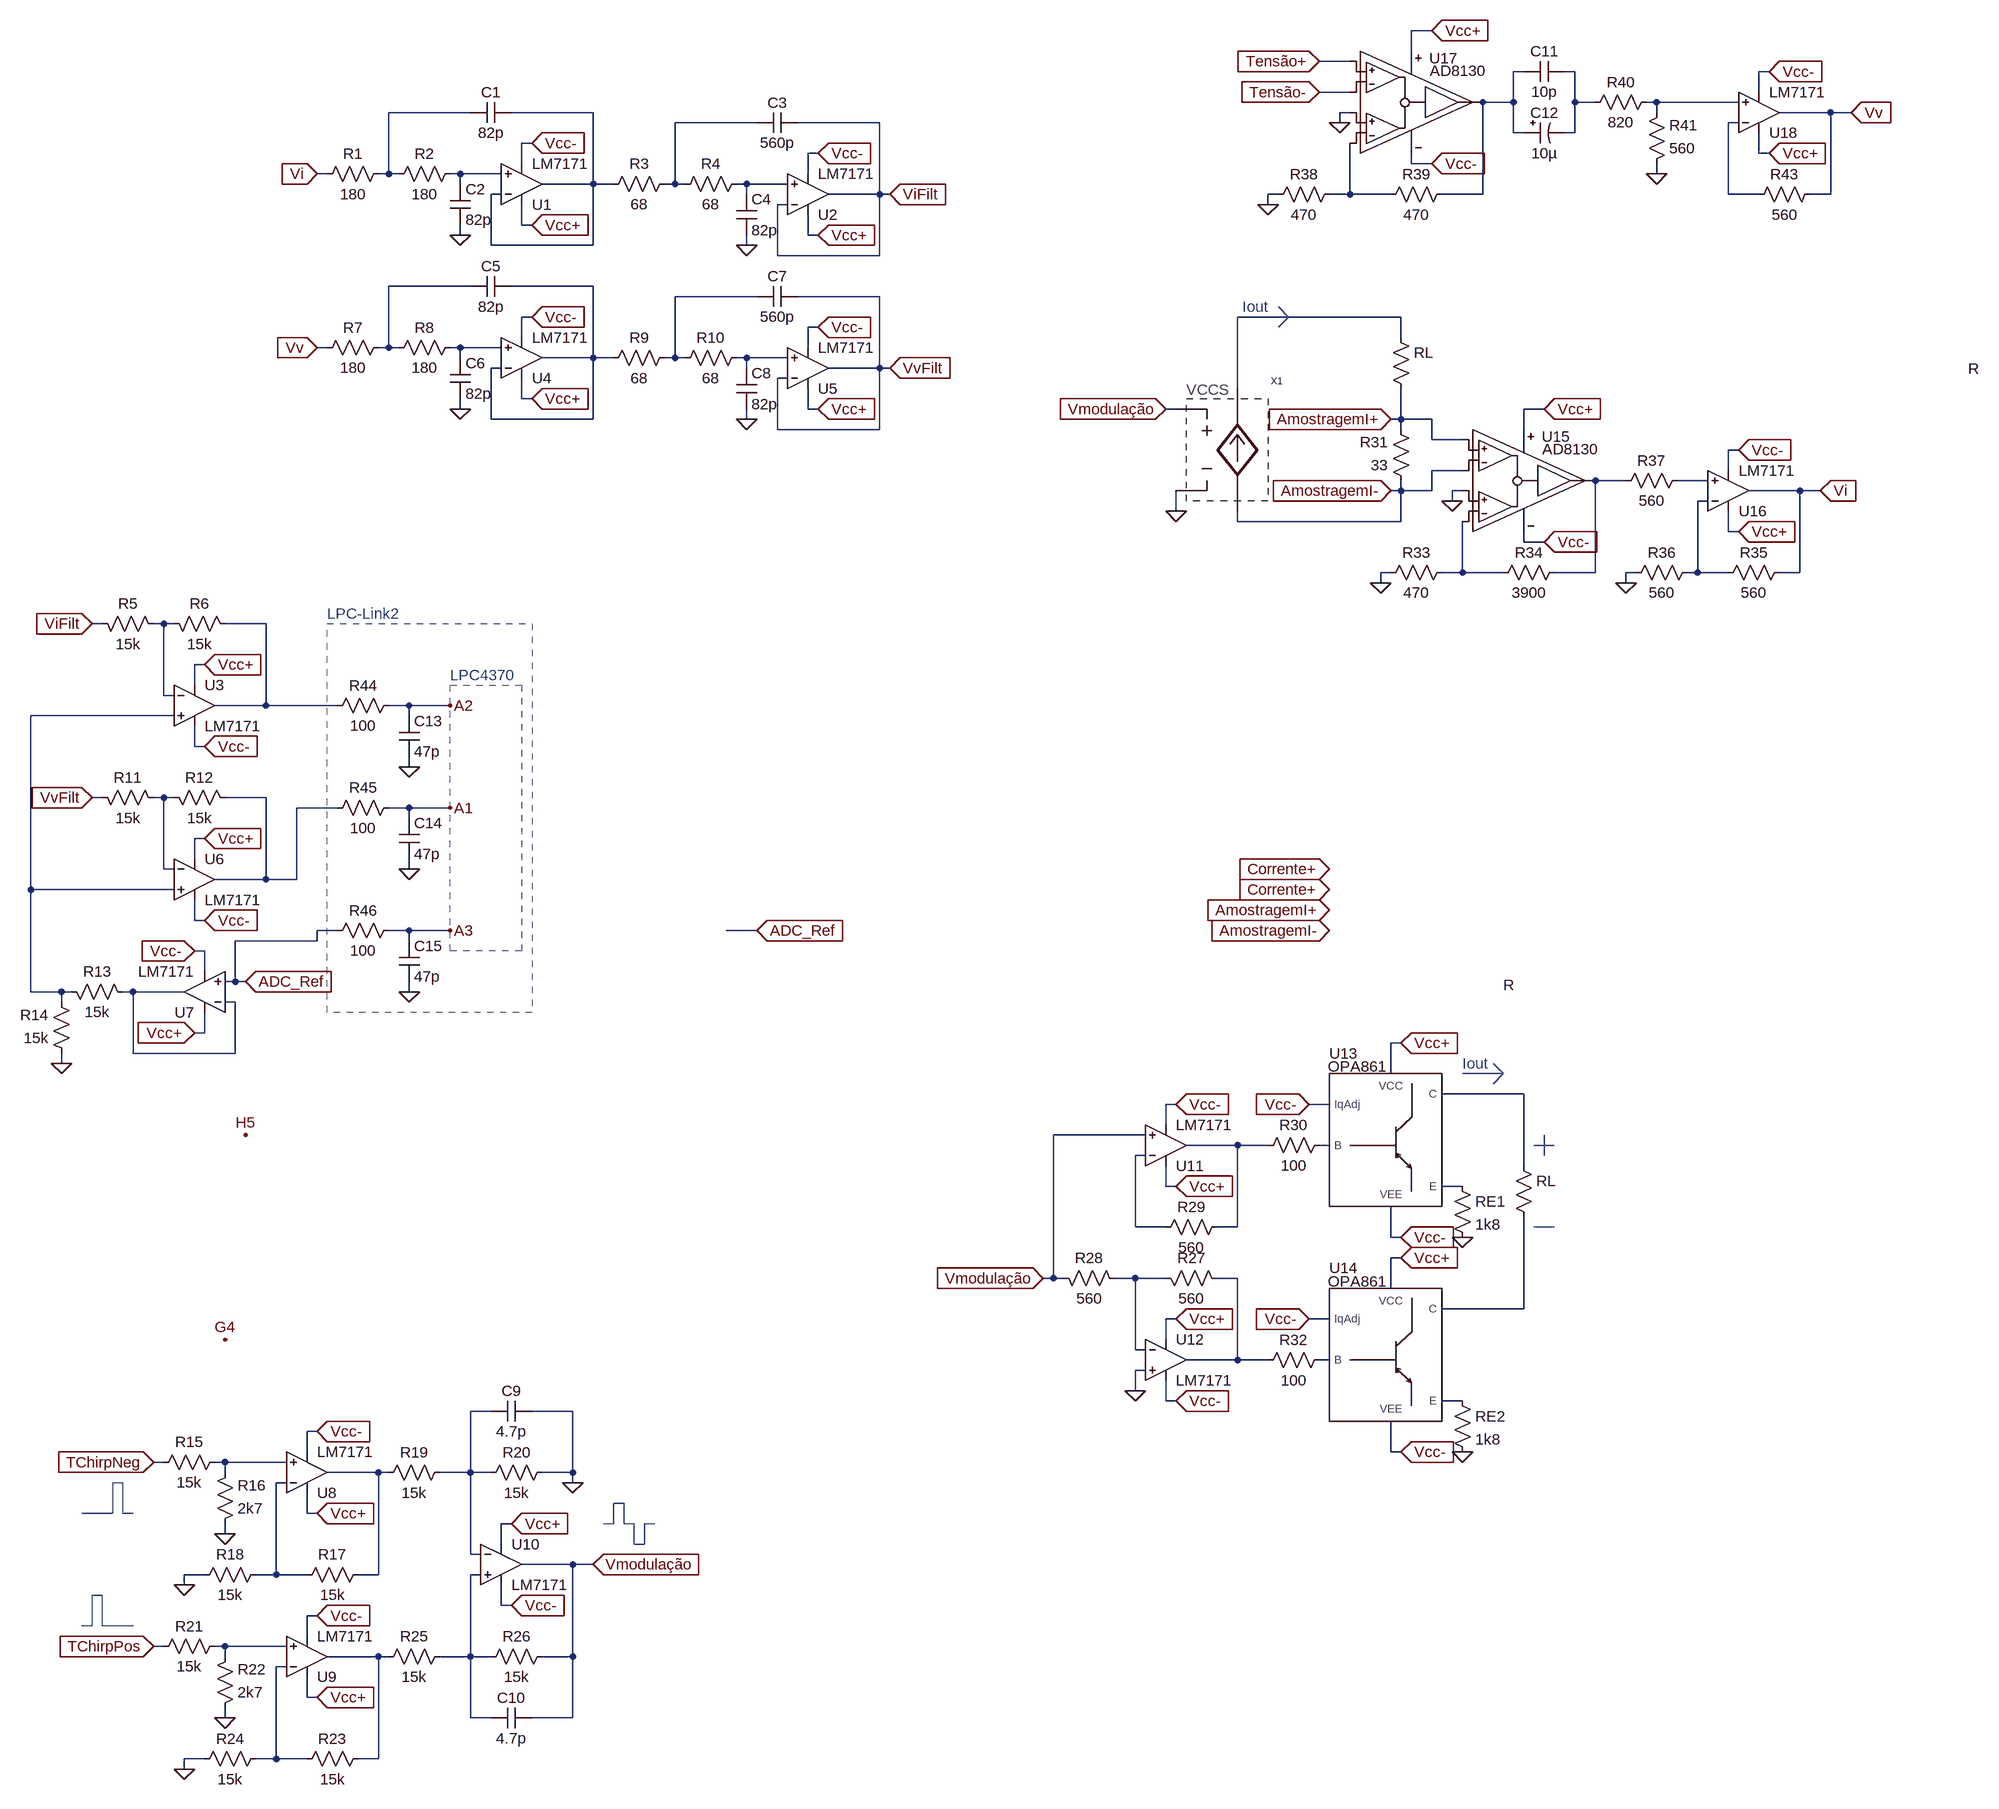
[diagram p0: schematic Circuito completo.asc]
Circuito completo.asc, the LTspice schematic file:
Version 4
SHEET 1 960 1104
WIRE -3152 -1648 -3184 -1648
WIRE -3184 -1616 -3184 -1648
WIRE -3280 -1600 -3328 -1600
WIRE -3008 -1584 -3024 -1584
WIRE -2928 -1584 -2944 -1584
WIRE -2624 -1584 -2640 -1584
WIRE -3280 -1552 -3328 -1552
WIRE -2640 -1552 -2640 -1584
WIRE -3024 -1536 -3024 -1584
WIRE -3024 -1536 -3072 -1536
WIRE -2928 -1536 -2928 -1584
WIRE -2896 -1536 -2928 -1536
WIRE -2800 -1536 -2816 -1536
WIRE -2672 -1536 -2800 -1536
WIRE -4656 -1520 -4784 -1520
WIRE -4464 -1520 -4592 -1520
WIRE -3280 -1520 -3296 -1520
WIRE -2800 -1520 -2800 -1536
WIRE -2528 -1520 -2608 -1520
WIRE -2496 -1520 -2528 -1520
WIRE -4208 -1504 -4336 -1504
WIRE -4016 -1504 -4144 -1504
WIRE -3296 -1504 -3296 -1520
WIRE -2672 -1504 -2688 -1504
WIRE -3024 -1488 -3024 -1536
WIRE -3008 -1488 -3024 -1488
WIRE -2928 -1488 -2928 -1536
WIRE -2928 -1488 -2944 -1488
WIRE -4560 -1472 -4576 -1472
WIRE -4112 -1456 -4128 -1456
WIRE -2640 -1456 -2640 -1488
WIRE -2624 -1456 -2640 -1456
WIRE -4576 -1440 -4576 -1472
WIRE -3184 -1440 -3184 -1456
WIRE -3152 -1440 -3184 -1440
WIRE -4880 -1424 -4896 -1424
WIRE -4784 -1424 -4784 -1520
WIRE -4784 -1424 -4800 -1424
WIRE -4768 -1424 -4784 -1424
WIRE -4672 -1424 -4688 -1424
WIRE -4608 -1424 -4672 -1424
WIRE -4128 -1424 -4128 -1456
WIRE -2800 -1424 -2800 -1440
WIRE -4672 -1408 -4672 -1424
WIRE -4464 -1408 -4464 -1520
WIRE -4464 -1408 -4544 -1408
WIRE -4432 -1408 -4464 -1408
WIRE -4336 -1408 -4336 -1504
WIRE -4336 -1408 -4352 -1408
WIRE -4320 -1408 -4336 -1408
WIRE -4224 -1408 -4240 -1408
WIRE -4160 -1408 -4224 -1408
WIRE -4608 -1392 -4624 -1392
WIRE -4224 -1392 -4224 -1408
WIRE -4016 -1392 -4016 -1504
WIRE -4016 -1392 -4096 -1392
WIRE -4000 -1392 -4016 -1392
WIRE -3392 -1392 -3408 -1392
WIRE -3280 -1392 -3280 -1472
WIRE -3280 -1392 -3312 -1392
WIRE -3216 -1392 -3280 -1392
WIRE -3072 -1392 -3072 -1536
WIRE -3072 -1392 -3136 -1392
WIRE -2688 -1392 -2688 -1504
WIRE -2640 -1392 -2688 -1392
WIRE -2528 -1392 -2528 -1520
WIRE -2528 -1392 -2560 -1392
WIRE -4160 -1376 -4176 -1376
WIRE -3408 -1376 -3408 -1392
WIRE -4576 -1344 -4576 -1376
WIRE -4560 -1344 -4576 -1344
WIRE -4672 -1328 -4672 -1344
WIRE -4128 -1328 -4128 -1360
WIRE -4112 -1328 -4128 -1328
WIRE -4624 -1312 -4624 -1392
WIRE -4464 -1312 -4464 -1408
WIRE -4464 -1312 -4624 -1312
WIRE -4224 -1312 -4224 -1328
WIRE -4176 -1296 -4176 -1376
WIRE -4016 -1296 -4016 -1392
WIRE -4016 -1296 -4176 -1296
WIRE -4656 -1248 -4784 -1248
WIRE -4464 -1248 -4592 -1248
WIRE -4208 -1232 -4336 -1232
WIRE -4016 -1232 -4144 -1232
WIRE -4560 -1200 -4576 -1200
WIRE -3200 -1200 -3456 -1200
WIRE -4112 -1184 -4128 -1184
WIRE -4576 -1168 -4576 -1200
WIRE -3200 -1168 -3200 -1200
WIRE -4880 -1152 -4896 -1152
WIRE -4784 -1152 -4784 -1248
WIRE -4784 -1152 -4800 -1152
WIRE -4768 -1152 -4784 -1152
WIRE -4672 -1152 -4688 -1152
WIRE -4608 -1152 -4672 -1152
WIRE -4128 -1152 -4128 -1184
WIRE -4672 -1136 -4672 -1152
WIRE -4464 -1136 -4464 -1248
WIRE -4464 -1136 -4544 -1136
WIRE -4432 -1136 -4464 -1136
WIRE -4336 -1136 -4336 -1232
WIRE -4336 -1136 -4352 -1136
WIRE -4320 -1136 -4336 -1136
WIRE -4224 -1136 -4240 -1136
WIRE -4160 -1136 -4224 -1136
WIRE -4608 -1120 -4624 -1120
WIRE -4224 -1120 -4224 -1136
WIRE -4016 -1120 -4016 -1232
WIRE -4016 -1120 -4096 -1120
WIRE -4000 -1120 -4016 -1120
WIRE -4160 -1104 -4176 -1104
WIRE -3456 -1088 -3456 -1200
WIRE -4576 -1072 -4576 -1104
WIRE -4560 -1072 -4576 -1072
WIRE -4672 -1056 -4672 -1072
WIRE -4128 -1056 -4128 -1088
WIRE -4112 -1056 -4128 -1056
WIRE -3552 -1056 -3568 -1056
WIRE -2976 -1056 -3008 -1056
WIRE -4624 -1040 -4624 -1120
WIRE -4464 -1040 -4464 -1136
WIRE -4464 -1040 -4624 -1040
WIRE -4224 -1040 -4224 -1056
WIRE -3200 -1040 -3200 -1088
WIRE -3200 -1040 -3216 -1040
WIRE -3152 -1040 -3200 -1040
WIRE -4176 -1024 -4176 -1104
WIRE -4016 -1024 -4016 -1120
WIRE -4016 -1024 -4176 -1024
WIRE -3200 -1024 -3200 -1040
WIRE -3008 -1024 -3008 -1056
WIRE -3152 -1008 -3152 -1040
WIRE -3104 -1008 -3152 -1008
WIRE -2672 -992 -2688 -992
WIRE -3104 -960 -3152 -960
WIRE -2688 -960 -2688 -992
WIRE -2848 -944 -2896 -944
WIRE -2720 -944 -2768 -944
WIRE -3200 -928 -3200 -944
WIRE -3200 -928 -3216 -928
WIRE -3152 -928 -3152 -960
WIRE -3152 -928 -3200 -928
WIRE -3104 -928 -3120 -928
WIRE -2576 -928 -2656 -928
WIRE -2544 -928 -2576 -928
WIRE -3120 -912 -3120 -928
WIRE -2720 -912 -2736 -912
WIRE -3552 -896 -3552 -928
WIRE -3456 -880 -3456 -896
WIRE -3200 -880 -3200 -928
WIRE -3200 -880 -3456 -880
WIRE -2688 -864 -2688 -896
WIRE -2672 -864 -2688 -864
WIRE -3008 -848 -3008 -864
WIRE -2976 -848 -3008 -848
WIRE -3216 -800 -3232 -800
WIRE -3104 -800 -3104 -880
WIRE -3104 -800 -3136 -800
WIRE -3040 -800 -3104 -800
WIRE -2896 -800 -2896 -944
WIRE -2896 -800 -2960 -800
WIRE -2832 -800 -2848 -800
WIRE -2736 -800 -2736 -912
WIRE -2736 -800 -2752 -800
WIRE -2688 -800 -2736 -800
WIRE -2576 -800 -2576 -928
WIRE -2576 -800 -2608 -800
WIRE -3232 -784 -3232 -800
WIRE -2848 -784 -2848 -800
WIRE -5232 -720 -5248 -720
WIRE -5136 -720 -5152 -720
WIRE -5120 -720 -5136 -720
WIRE -4976 -720 -5040 -720
WIRE -5072 -656 -5088 -656
WIRE -5088 -624 -5088 -656
WIRE -5136 -608 -5136 -720
WIRE -5120 -608 -5136 -608
WIRE -4976 -592 -4976 -720
WIRE -4976 -592 -5056 -592
WIRE -4864 -592 -4976 -592
WIRE -4752 -592 -4784 -592
WIRE -4688 -592 -4752 -592
WIRE -5120 -576 -5344 -576
WIRE -4752 -576 -4752 -592
WIRE -5088 -528 -5088 -560
WIRE -5072 -528 -5088 -528
WIRE -4752 -496 -4752 -512
WIRE -5232 -448 -5248 -448
WIRE -5136 -448 -5152 -448
WIRE -5120 -448 -5136 -448
WIRE -4976 -448 -5040 -448
WIRE -4864 -432 -4928 -432
WIRE -4752 -432 -4784 -432
WIRE -4688 -432 -4752 -432
WIRE -4752 -416 -4752 -432
WIRE -5072 -384 -5088 -384
WIRE -5088 -352 -5088 -384
WIRE -5136 -336 -5136 -448
WIRE -5120 -336 -5136 -336
WIRE -4752 -336 -4752 -352
WIRE -4976 -320 -4976 -448
WIRE -4976 -320 -5056 -320
WIRE -4928 -320 -4928 -432
WIRE -4928 -320 -4976 -320
WIRE -5344 -304 -5344 -576
WIRE -5120 -304 -5344 -304
WIRE -5088 -256 -5088 -288
WIRE -5072 -256 -5088 -256
WIRE -4864 -240 -4896 -240
WIRE -4752 -240 -4784 -240
WIRE -4688 -240 -4752 -240
WIRE -4208 -240 -4256 -240
WIRE -4896 -224 -4896 -240
WIRE -4896 -224 -5024 -224
WIRE -4752 -224 -4752 -240
WIRE -5072 -208 -5088 -208
WIRE -5072 -176 -5072 -208
WIRE -5024 -160 -5024 -224
WIRE -5024 -160 -5040 -160
WIRE -5008 -160 -5024 -160
WIRE -5344 -144 -5344 -304
WIRE -5296 -144 -5344 -144
WIRE -5280 -144 -5296 -144
WIRE -5184 -144 -5200 -144
WIRE -5104 -144 -5184 -144
WIRE -4752 -144 -4752 -160
WIRE -5296 -128 -5296 -144
WIRE -5024 -128 -5040 -128
WIRE -5072 -80 -5072 -112
WIRE -5072 -80 -5088 -80
WIRE -3200 -64 -3216 -64
WIRE -5184 -48 -5184 -144
WIRE -5024 -48 -5024 -128
WIRE -5024 -48 -5184 -48
WIRE -5296 -32 -5296 -48
WIRE -3216 -16 -3216 -64
WIRE -3008 16 -3136 16
WIRE -3552 32 -3568 32
WIRE -3312 32 -3344 32
WIRE -3568 64 -3568 32
WIRE -3600 80 -3744 80
WIRE -3456 96 -3536 96
WIRE -3408 96 -3456 96
WIRE -3312 96 -3328 96
WIRE -3600 112 -3616 112
WIRE -3008 128 -3008 16
WIRE -3568 160 -3568 128
WIRE -3552 160 -3568 160
WIRE -3104 160 -3136 160
WIRE -3616 224 -3616 112
WIRE -3568 224 -3616 224
WIRE -3456 224 -3456 96
WIRE -3456 224 -3488 224
WIRE -3216 240 -3216 192
WIRE -3200 240 -3216 240
WIRE -3200 272 -3216 272
WIRE -3744 304 -3744 80
WIRE -3744 304 -3760 304
WIRE -3728 304 -3744 304
WIRE -3616 304 -3648 304
WIRE -3568 304 -3616 304
WIRE -3456 304 -3488 304
WIRE -3216 320 -3216 272
WIRE -3008 352 -3008 208
WIRE -3008 352 -3136 352
WIRE -3552 368 -3568 368
WIRE -3312 368 -3344 368
WIRE -3568 400 -3568 368
WIRE -3616 416 -3616 304
WIRE -3600 416 -3616 416
WIRE -3456 432 -3456 304
WIRE -3456 432 -3536 432
WIRE -3408 432 -3456 432
WIRE -3312 432 -3328 432
WIRE -3600 448 -3616 448
WIRE -3616 480 -3616 448
WIRE -3568 496 -3568 464
WIRE -3552 496 -3568 496
WIRE -3104 496 -3136 496
WIRE -4624 512 -4656 512
WIRE -4496 512 -4560 512
WIRE -4896 544 -4912 544
WIRE -4912 576 -4912 544
WIRE -3216 576 -3216 528
WIRE -3200 576 -3216 576
WIRE -5136 592 -5152 592
WIRE -5040 592 -5056 592
WIRE -4944 592 -5040 592
WIRE -5040 608 -5040 592
WIRE -4800 608 -4880 608
WIRE -4784 608 -4800 608
WIRE -4656 608 -4656 512
WIRE -4656 608 -4704 608
WIRE -4624 608 -4656 608
WIRE -4496 608 -4496 512
WIRE -4496 608 -4544 608
WIRE -4944 624 -4960 624
WIRE -4496 624 -4496 608
WIRE -4912 672 -4912 640
WIRE -4896 672 -4912 672
WIRE -4592 688 -4608 688
WIRE -5040 704 -5040 688
WIRE -4608 720 -4608 688
WIRE -4656 736 -4656 608
WIRE -4640 736 -4656 736
WIRE -4496 752 -4576 752
WIRE -4464 752 -4496 752
WIRE -5072 768 -5104 768
WIRE -4960 768 -4960 624
WIRE -4960 768 -4992 768
WIRE -4912 768 -4960 768
WIRE -4800 768 -4800 608
WIRE -4800 768 -4832 768
WIRE -4640 768 -4656 768
WIRE -5104 784 -5104 768
WIRE -4608 816 -4608 784
WIRE -4592 816 -4608 816
WIRE -4896 832 -4912 832
WIRE -4912 864 -4912 832
WIRE -5136 880 -5152 880
WIRE -5040 880 -5056 880
WIRE -4944 880 -5040 880
WIRE -5040 896 -5040 880
WIRE -4800 896 -4880 896
WIRE -4784 896 -4800 896
WIRE -4656 896 -4656 768
WIRE -4656 896 -4704 896
WIRE -4624 896 -4656 896
WIRE -4496 896 -4496 752
WIRE -4496 896 -4544 896
WIRE -4944 912 -4960 912
WIRE -4912 960 -4912 928
WIRE -4896 960 -4912 960
WIRE -5040 992 -5040 976
WIRE -4656 992 -4656 896
WIRE -4624 992 -4656 992
WIRE -4496 992 -4496 896
WIRE -4496 992 -4560 992
WIRE -5072 1056 -5104 1056
WIRE -4960 1056 -4960 912
WIRE -4960 1056 -4992 1056
WIRE -4912 1056 -4960 1056
WIRE -4800 1056 -4800 896
WIRE -4800 1056 -4832 1056
WIRE -5104 1072 -5104 1056
FLAG -4672 -1328 0
FLAG -4560 -1344 Vcc+
IOPIN -4560 -1344 In
FLAG -4560 -1472 Vcc-
IOPIN -4560 -1472 In
FLAG -4224 -1312 0
FLAG -4112 -1328 Vcc+
IOPIN -4112 -1328 In
FLAG -4112 -1456 Vcc-
IOPIN -4112 -1456 In
FLAG -5072 -656 Vcc+
IOPIN -5072 -656 In
FLAG -5072 -528 Vcc-
IOPIN -5072 -528 In
FLAG -4672 -1056 0
FLAG -4560 -1072 Vcc+
IOPIN -4560 -1072 In
FLAG -4560 -1200 Vcc-
IOPIN -4560 -1200 In
FLAG -4224 -1040 0
FLAG -4112 -1056 Vcc+
IOPIN -4112 -1056 In
FLAG -4112 -1184 Vcc-
IOPIN -4112 -1184 In
FLAG -5072 -384 Vcc+
IOPIN -5072 -384 In
FLAG -5072 -256 Vcc-
IOPIN -5072 -256 In
FLAG -5088 -80 Vcc+
IOPIN -5088 -80 In
FLAG -5088 -208 Vcc-
IOPIN -5088 -208 In
FLAG -5296 -32 0
FLAG -4208 -240 ADC_Ref
IOPIN -4208 -240 In
FLAG -4896 672 Vcc+
IOPIN -4896 672 In
FLAG -4896 544 Vcc-
IOPIN -4896 544 In
FLAG -5040 704 0
FLAG -4896 960 Vcc+
IOPIN -4896 960 In
FLAG -4896 832 Vcc-
IOPIN -4896 832 In
FLAG -5040 992 0
FLAG -4592 688 Vcc+
IOPIN -4592 688 In
FLAG -4592 816 Vcc-
IOPIN -4592 816 In
FLAG -4496 624 0
FLAG -5152 592 TChirpNeg
IOPIN -5152 592 In
FLAG -5152 880 TChirpPos
IOPIN -5152 880 In
FLAG -5104 1072 0
FLAG -5104 784 0
FLAG -3552 160 Vcc+
IOPIN -3552 160 In
FLAG -3552 32 Vcc-
IOPIN -3552 32 In
FLAG -3552 368 Vcc+
IOPIN -3552 368 In
FLAG -3552 496 Vcc-
IOPIN -3552 496 In
FLAG -3200 240 Vcc-
IOPIN -3200 240 In
FLAG -3200 -64 Vcc+
IOPIN -3200 -64 In
FLAG -3104 240 0
FLAG -3200 576 Vcc-
IOPIN -3200 576 In
FLAG -3200 272 Vcc+
IOPIN -3200 272 In
FLAG -3104 576 0
FLAG -3344 32 Vcc-
IOPIN -3344 32 In
FLAG -3344 368 Vcc-
IOPIN -3344 368 In
FLAG -3120 -912 0
FLAG -3232 -784 0
FLAG -2672 -864 Vcc+
IOPIN -2672 -864 In
FLAG -2672 -992 Vcc-
IOPIN -2672 -992 In
FLAG -2848 -784 0
FLAG -2976 -848 Vcc-
IOPIN -2976 -848 In
FLAG -2976 -1056 Vcc+
IOPIN -2976 -1056 In
FLAG -3312 -240 AmostragemI-
IOPIN -3312 -240 In
FLAG -3312 -272 AmostragemI+
IOPIN -3312 -272 In
FLAG -3216 -928 AmostragemI-
IOPIN -3216 -928 In
FLAG -3216 -1040 AmostragemI+
IOPIN -3216 -1040 In
FLAG -3296 -1504 0
FLAG -3408 -1376 0
FLAG -2624 -1456 Vcc+
IOPIN -2624 -1456 In
FLAG -2624 -1584 Vcc-
IOPIN -2624 -1584 In
FLAG -3152 -1440 Vcc-
IOPIN -3152 -1440 In
FLAG -3152 -1648 Vcc+
IOPIN -3152 -1648 In
FLAG -3328 -1552 Tensão-
IOPIN -3328 -1552 In
FLAG -3328 -1600 Tensão+
IOPIN -3328 -1600 In
FLAG -2800 -1424 0
FLAG -2544 -928 Vi
IOPIN -2544 -928 In
FLAG -2496 -1520 Vv
IOPIN -2496 -1520 In
FLAG -3312 -304 Corrente+
IOPIN -3312 -304 In
FLAG -3312 -336 Corrente+
IOPIN -3312 -336 In
FLAG -4752 -496 0
FLAG -4752 -336 0
FLAG -4896 -1424 Vi
IOPIN -4896 -1424 In
FLAG -4896 -1152 Vv
IOPIN -4896 -1152 In
FLAG -4752 -144 0
FLAG -5008 -160 ADC_Ref
IOPIN -5008 -160 In
FLAG -4688 -592 A2
FLAG -4688 -432 A1
FLAG -4688 -240 A3
FLAG -3760 304 Vmodulação
IOPIN -3760 304 In
FLAG -4464 752 Vmodulação
IOPIN -4464 752 In
FLAG -5008 80 H5
FLAG -5040 400 G4
FLAG -4000 -1392 ViFilt
IOPIN -4000 -1392 In
FLAG -4000 -1120 VvFilt
IOPIN -4000 -1120 In
FLAG -5248 -720 ViFilt
IOPIN -5248 -720 In
FLAG -5248 -448 VvFilt
IOPIN -5248 -448 In
FLAG -3616 480 0
FLAG -3568 -1056 Vmodulação
IOPIN -3568 -1056 In
FLAG -3552 -896 0
SYMBOL Opamps\\opamp2 -4576 -1344 M180
SYMATTR InstName U1
SYMATTR Value LM7171
SYMBOL res -4784 -1440 R90
WINDOW 0 0 56 VBottom 2
WINDOW 3 32 56 VTop 2
SYMATTR InstName R1
SYMATTR Value 180
SYMBOL res -4672 -1440 R90
WINDOW 0 0 56 VBottom 2
WINDOW 3 32 56 VTop 2
SYMATTR InstName R2
SYMATTR Value 180
SYMBOL cap -4592 -1536 R90
WINDOW 0 0 32 VBottom 2
WINDOW 3 32 32 VTop 2
SYMATTR InstName C1
SYMATTR Value 82p
SYMBOL cap -4688 -1408 R0
SYMATTR InstName C2
SYMATTR Value 82p
SYMBOL Opamps\\opamp2 -4128 -1328 M180
SYMATTR InstName U2
SYMATTR Value LM7171
SYMBOL res -4336 -1424 R90
WINDOW 0 0 56 VBottom 2
WINDOW 3 32 56 VTop 2
SYMATTR InstName R3
SYMATTR Value 68
SYMBOL res -4224 -1424 R90
WINDOW 0 0 56 VBottom 2
WINDOW 3 32 56 VTop 2
SYMATTR InstName R4
SYMATTR Value 68
SYMBOL cap -4144 -1520 R90
WINDOW 0 0 32 VBottom 2
WINDOW 3 32 32 VTop 2
SYMATTR InstName C3
SYMATTR Value 560p
SYMBOL cap -4240 -1392 R0
SYMATTR InstName C4
SYMATTR Value 82p
SYMBOL Opamps\\opamp2 -5088 -656 R0
SYMATTR InstName U3
SYMATTR Value LM7171
SYMBOL res -5136 -704 M270
WINDOW 0 32 56 VTop 2
WINDOW 3 0 56 VBottom 2
SYMATTR InstName R5
SYMATTR Value 15k
SYMBOL res -5024 -704 M270
WINDOW 0 32 56 VTop 2
WINDOW 3 0 56 VBottom 2
SYMATTR InstName R6
SYMATTR Value 15k
SYMBOL Opamps\\opamp2 -4576 -1072 M180
SYMATTR InstName U4
SYMATTR Value LM7171
SYMBOL res -4784 -1168 R90
WINDOW 0 0 56 VBottom 2
WINDOW 3 32 56 VTop 2
SYMATTR InstName R7
SYMATTR Value 180
SYMBOL res -4672 -1168 R90
WINDOW 0 0 56 VBottom 2
WINDOW 3 32 56 VTop 2
SYMATTR InstName R8
SYMATTR Value 180
SYMBOL cap -4592 -1264 R90
WINDOW 0 0 32 VBottom 2
WINDOW 3 32 32 VTop 2
SYMATTR InstName C5
SYMATTR Value 82p
SYMBOL cap -4688 -1136 R0
SYMATTR InstName C6
SYMATTR Value 82p
SYMBOL Opamps\\opamp2 -4128 -1056 M180
SYMATTR InstName U5
SYMATTR Value LM7171
SYMBOL res -4336 -1152 R90
WINDOW 0 0 56 VBottom 2
WINDOW 3 32 56 VTop 2
SYMATTR InstName R9
SYMATTR Value 68
SYMBOL res -4224 -1152 R90
WINDOW 0 0 56 VBottom 2
WINDOW 3 32 56 VTop 2
SYMATTR InstName R10
SYMATTR Value 68
SYMBOL cap -4144 -1248 R90
WINDOW 0 0 32 VBottom 2
WINDOW 3 32 32 VTop 2
SYMATTR InstName C7
SYMATTR Value 560p
SYMBOL cap -4240 -1120 R0
SYMATTR InstName C8
SYMATTR Value 82p
SYMBOL Opamps\\opamp2 -5088 -384 R0
SYMATTR InstName U6
SYMATTR Value LM7171
SYMBOL res -5136 -432 M270
WINDOW 0 32 56 VTop 2
WINDOW 3 0 56 VBottom 2
SYMATTR InstName R11
SYMATTR Value 15k
SYMBOL res -5024 -432 M270
WINDOW 0 32 56 VTop 2
WINDOW 3 0 56 VBottom 2
SYMATTR InstName R12
SYMATTR Value 15k
SYMBOL Opamps\\opamp2 -5072 -80 R180
SYMATTR InstName U7
SYMATTR Value LM7171
SYMBOL res -5296 -160 M90
WINDOW 0 0 56 VBottom 2
WINDOW 3 32 56 VTop 2
SYMATTR InstName R13
SYMATTR Value 15k
SYMBOL res -5280 -32 R180
WINDOW 0 36 76 Left 2
WINDOW 3 36 40 Left 2
SYMATTR InstName R14
SYMATTR Value 15k
SYMBOL Opamps\\opamp2 -4912 672 M180
SYMATTR InstName U8
SYMATTR Value LM7171
SYMBOL res -5040 576 R90
WINDOW 0 0 56 VBottom 2
WINDOW 3 32 56 VTop 2
SYMATTR InstName R15
SYMATTR Value 15k
SYMBOL res -5056 704 M180
WINDOW 0 36 76 Left 2
WINDOW 3 36 40 Left 2
SYMATTR InstName R16
SYMATTR Value 2k7
SYMBOL res -4816 752 R90
WINDOW 0 0 56 VBottom 2
WINDOW 3 32 56 VTop 2
SYMATTR InstName R17
SYMATTR Value 15k
SYMBOL res -5088 784 R270
WINDOW 0 32 56 VTop 2
WINDOW 3 0 56 VBottom 2
SYMATTR InstName R18
SYMATTR Value 15k
SYMBOL res -4688 592 R90
WINDOW 0 0 56 VBottom 2
WINDOW 3 32 56 VTop 2
SYMATTR InstName R19
SYMATTR Value 15k
SYMBOL res -4528 592 R90
WINDOW 0 0 56 VBottom 2
WINDOW 3 32 56 VTop 2
SYMATTR InstName R20
SYMATTR Value 15k
SYMBOL cap -4560 496 R90
WINDOW 0 0 32 VBottom 2
WINDOW 3 32 32 VTop 2
SYMATTR InstName C9
SYMATTR Value 4.7p
SYMBOL Opamps\\opamp2 -4912 960 M180
SYMATTR InstName U9
SYMATTR Value LM7171
SYMBOL res -5040 864 R90
WINDOW 0 0 56 VBottom 2
WINDOW 3 32 56 VTop 2
SYMATTR InstName R21
SYMATTR Value 15k
SYMBOL res -5056 992 M180
WINDOW 0 36 76 Left 2
WINDOW 3 36 40 Left 2
SYMATTR InstName R22
SYMATTR Value 2k7
SYMBOL res -4816 1040 R90
WINDOW 0 0 56 VBottom 2
WINDOW 3 32 56 VTop 2
SYMATTR InstName R23
SYMATTR Value 15k
SYMBOL res -5088 1072 R270
WINDOW 0 32 56 VTop 2
WINDOW 3 0 56 VBottom 2
SYMATTR InstName R24
SYMATTR Value 15k
SYMBOL Opamps\\opamp2 -4608 688 R0
SYMATTR InstName U10
SYMATTR Value LM7171
SYMBOL res -4688 880 R90
WINDOW 0 0 56 VBottom 2
WINDOW 3 32 56 VTop 2
SYMATTR InstName R25
SYMATTR Value 15k
SYMBOL res -4528 880 R90
WINDOW 0 0 56 VBottom 2
WINDOW 3 32 56 VTop 2
SYMATTR InstName R26
SYMATTR Value 15k
SYMBOL cap -4560 976 R90
WINDOW 0 0 32 VBottom 2
WINDOW 3 32 32 VTop 2
SYMATTR InstName C10
SYMATTR Value 4.7p
SYMBOL Opamps\\opamp2 -3568 160 M180
SYMATTR InstName U11
SYMATTR Value LM7171
SYMBOL res -3472 208 R90
WINDOW 0 0 56 VBottom 2
WINDOW 3 32 56 VTop 2
SYMATTR InstName R29
SYMATTR Value 560
SYMBOL Opamps\\opamp2 -3568 368 R0
SYMATTR InstName U12
SYMATTR Value LM7171
SYMBOL res -3472 320 M270
WINDOW 0 32 56 VTop 2
WINDOW 3 0 56 VBottom 2
SYMATTR InstName R27
SYMATTR Value 560
SYMBOL res -3632 320 M270
WINDOW 0 32 56 VTop 2
WINDOW 3 0 56 VBottom 2
SYMATTR InstName R28
SYMATTR Value 560
SYMBOL opa681 -3248 128 R0
SYMATTR InstName U13
SYMBOL res -3120 144 R0
SYMATTR InstName RE1
SYMATTR Value 1k8
SYMBOL res -3312 80 R90
WINDOW 0 0 56 VBottom 2
WINDOW 3 32 56 VTop 2
SYMATTR InstName R30
SYMATTR Value 100
SYMBOL opa681 -3248 464 R0
SYMATTR InstName U14
SYMBOL res -3120 480 R0
SYMATTR InstName RE2
SYMATTR Value 1k8
SYMBOL res -3312 416 R90
WINDOW 0 0 56 VBottom 2
WINDOW 3 32 56 VTop 2
SYMATTR InstName R32
SYMATTR Value 100
SYMBOL res -3184 -928 R180
WINDOW 0 36 76 Left 2
WINDOW 3 36 40 Left 2
SYMATTR InstName R31
SYMATTR Value 33
SYMBOL ad8130 -3024 -944 R0
SYMATTR InstName U15
SYMBOL res -3120 -816 R90
WINDOW 0 0 56 VBottom 2
WINDOW 3 32 56 VTop 2
SYMATTR InstName R33
SYMATTR Value 470
SYMBOL res -2944 -816 R90
WINDOW 0 0 56 VBottom 2
WINDOW 3 32 56 VTop 2
SYMATTR InstName R34
SYMATTR Value 3900
SYMBOL res -2752 -960 R90
WINDOW 0 0 56 VBottom 2
WINDOW 3 32 56 VTop 2
SYMATTR InstName R37
SYMATTR Value 560
SYMBOL Opamps\\opamp2 -2688 -864 M180
SYMATTR InstName U16
SYMATTR Value LM7171
SYMBOL res -2592 -816 R90
WINDOW 0 0 56 VBottom 2
WINDOW 3 32 56 VTop 2
SYMATTR InstName R35
SYMATTR Value 560
SYMBOL res -2736 -816 R90
WINDOW 0 0 56 VBottom 2
WINDOW 3 32 56 VTop 2
SYMATTR InstName R36
SYMATTR Value 560
SYMBOL ad8130 -3200 -1536 R0
SYMATTR InstName U17
SYMBOL res -3296 -1408 R90
WINDOW 0 0 56 VBottom 2
WINDOW 3 32 56 VTop 2
SYMATTR InstName R38
SYMATTR Value 470
SYMBOL res -3120 -1408 R90
WINDOW 0 0 56 VBottom 2
WINDOW 3 32 56 VTop 2
SYMATTR InstName R39
SYMATTR Value 470
SYMBOL res -2800 -1552 R90
WINDOW 0 0 56 VBottom 2
WINDOW 3 32 56 VTop 2
SYMATTR InstName R40
SYMATTR Value 820
SYMBOL Opamps\\opamp2 -2640 -1456 M180
SYMATTR InstName U18
SYMATTR Value LM7171
SYMBOL res -2544 -1408 R90
WINDOW 0 0 56 VBottom 2
WINDOW 3 32 56 VTop 2
SYMATTR InstName R43
SYMATTR Value 560
SYMBOL cap -2944 -1600 R90
WINDOW 0 0 32 VBottom 2
WINDOW 3 32 32 VTop 2
SYMATTR InstName C11
SYMATTR Value 10p
SYMBOL polcap -3008 -1504 M90
WINDOW 0 0 32 VBottom 2
WINDOW 3 32 32 VTop 2
SYMATTR InstName C12
SYMATTR Value 10µ
SYMATTR Description Capacitor
SYMATTR Type cap
SYMATTR SpiceLine V=4 Irms=3.72678 Rser=0.018 Lser=0 mfg="KEMET" pn="A700D107M004ATE018" type="Al electrolytic"
SYMBOL res -2816 -1424 M180
WINDOW 0 36 76 Left 2
WINDOW 3 36 40 Left 2
SYMATTR InstName R41
SYMATTR Value 560
SYMBOL res -4768 -608 R90
WINDOW 0 0 56 VBottom 2
WINDOW 3 32 56 VTop 2
SYMATTR InstName R44
SYMATTR Value 100
SYMBOL cap -4768 -576 R0
SYMATTR InstName C13
SYMATTR Value 47p
SYMBOL res -4768 -448 R90
WINDOW 0 0 56 VBottom 2
WINDOW 3 32 56 VTop 2
SYMATTR InstName R45
SYMATTR Value 100
SYMBOL cap -4768 -416 R0
SYMATTR InstName C14
SYMATTR Value 47p
SYMBOL res -4768 -256 R90
WINDOW 0 0 56 VBottom 2
WINDOW 3 32 56 VTop 2
SYMATTR InstName R46
SYMATTR Value 100
SYMBOL cap -4768 -224 R0
SYMATTR InstName C15
SYMATTR Value 47p
SYMBOL vccs -3456 -992 R0
SYMATTR InstName X1
SYMBOL res -3216 -1184 R0
WINDOW 3 903 65 Left 2
SYMATTR InstName RL
SYMBOL res -3024 112 R0
WINDOW 3 -16 -267 Left 2
SYMATTR InstName RL
TEXT -4880 -736 Left 2 ;LPC-Link2
TEXT -4688 -640 Left 2 ;LPC4370
TEXT -3448 -1216 Left 2 ;Iout
TEXT -3104 -32 Left 2 ;Iout
LINE Normal -5248 848 -5264 848
LINE Normal -5248 800 -5248 848
LINE Normal -5232 800 -5248 800
LINE Normal -5232 848 -5232 800
LINE Normal -5184 848 -5232 848
LINE Normal -5216 672 -5264 672
LINE Normal -5216 624 -5216 672
LINE Normal -5200 624 -5216 624
LINE Normal -5200 672 -5200 624
LINE Normal -5184 672 -5200 672
LINE Normal -4432 688 -4448 688
LINE Normal -4432 656 -4432 688
LINE Normal -4416 656 -4432 656
LINE Normal -4416 688 -4416 656
LINE Normal -4400 688 -4416 688
LINE Normal -4400 720 -4400 688
LINE Normal -4384 720 -4400 720
LINE Normal -4384 688 -4384 720
LINE Normal -4368 688 -4384 688
LINE Normal -3392 -1216 -3376 -1200
LINE Normal -3376 -1200 -3392 -1216 2
LINE Normal -3392 -1184 -3376 -1200
LINE Normal -2976 80 -2976 112
LINE Normal -2960 96 -2992 96
LINE Normal -2960 224 -2992 224
LINE Normal -3040 -16 -3104 -16
LINE Normal -3056 0 -3040 -16
LINE Normal -3040 -16 -3056 0
LINE Normal -3056 -32 -3040 -16
RECTANGLE Normal -4560 -112 -4880 -720 2
RECTANGLE Normal -4576 -208 -4688 -624 2

The netlist it stands for:
* Circuito completo.asc
XU1 N008 N005 Vcc+ Vcc- N005 LM7171  ; pins In+ In- V+ V- OUT
R1 N004 Vi 180
R2 N008 N004 180
C1 N005 N004 82p
C2 N008 0 82p
XU2 N009 ViFilt Vcc+ Vcc- ViFilt LM7171  ; pins In+ In- V+ V- OUT
R3 N006 N005 68
R4 N009 N006 68
C3 ViFilt N006 560p
C4 N009 0 82p
XU3 N023 N021 Vcc+ Vcc- N022 LM7171  ; pins In+ In- V+ V- OUT
R5 N021 ViFilt 15k
R6 N022 N021 15k
XU4 N015 N012 Vcc+ Vcc- N012 LM7171  ; pins In+ In- V+ V- OUT
R7 N011 Vv 180
R8 N015 N011 180
C5 N012 N011 82p
C6 N015 0 82p
XU5 N016 VvFilt Vcc+ Vcc- VvFilt LM7171  ; pins In+ In- V+ V- OUT
R9 N013 N012 68
R10 N016 N013 68
C7 VvFilt N013 560p
C8 N016 0 82p
XU6 N023 N024 Vcc+ Vcc- N025 LM7171  ; pins In+ In- V+ V- OUT
R11 N024 VvFilt 15k
R12 N025 N024 15k
XU7 ADC_Ref N026 Vcc+ Vcc- N026 LM7171  ; pins In+ In- V+ V- OUT
R13 N023 N026 15k
R14 0 N023 15k
XU8 N038 N040 Vcc+ Vcc- N039 LM7171  ; pins In+ In- V+ V- OUT
R15 N038 TChirpNeg 15k
R16 0 N038 2k7
R17 N039 N040 15k
R18 0 N040 15k
R19 N037 N039 15k
R20 0 N037 15k
C9 0 N037 4.7p
XU9 N042 N044 Vcc+ Vcc- N043 LM7171  ; pins In+ In- V+ V- OUT
R21 N042 TChirpPos 15k
R22 0 N042 2k7
R23 N043 N044 15k
R24 0 N044 15k
XU10 N041 N037 Vcc+ Vcc- Vmodulação LM7171  ; pins In+ In- V+ V- OUT
R25 N041 N043 15k
R26 Vmodulação N041 15k
C10 Vmodulação N041 4.7p
XU11 Vmodulação N030 Vcc+ Vcc- N028 LM7171  ; pins In+ In- V+ V- OUT
R29 N028 N030 560
XU12 0 N032 Vcc+ Vcc- N033 LM7171  ; pins In+ In- V+ V- OUT
R27 N033 N032 560
R28 N032 Vmodulação 560
XU13 N029 N027 N031 Vcc- Vcc+ Vcc- OPA861  ; pins B C E IqAdj VCC VEE
RE1 N031 0 1k8
R30 N029 N028 100
XU14 N035 N034 N036 Vcc- Vcc+ Vcc- OPA861  ; pins B C E IqAdj VCC VEE
RE2 N036 0 1k8
R32 N035 N033 100
R31 AmostragemI- AmostragemI+ 33
XU15 AmostragemI+ AmostragemI- 0 N020 Vcc+ Vcc- N017 AD8130  ; pins 1 2 3 4 99 50 45
R33 N020 0 470
R34 N017 N020 3900
R37 N018 N017 560
XU16 N018 N019 Vcc+ Vcc- Vi LM7171  ; pins In+ In- V+ V- OUT
R35 Vi N019 560
R36 N019 0 560
XU17 Tensão+ Tensão- 0 N010 Vcc+ Vcc- N001 AD8130  ; pins 1 2 3 4 99 50 45
R38 N010 0 470
R39 N001 N010 470
R40 N003 N002 820
XU18 N003 N007 Vcc+ Vcc- Vv LM7171  ; pins In+ In- V+ V- OUT
R43 Vv N007 560
C11 N002 N001 10p
C12 N001 N002 10µ V=4 Irms=3.72678 Rser=0.018 Lser=0 mfg="KEMET" pn="A700D107M004ATE018" type="Al electrolytic"
R41 0 N003 560
R44 A2 N022 100
C13 A2 0 47p
R45 A1 N025 100
C14 A1 0 47p
R46 A3 ADC_Ref 100
C15 A3 0 47p
XX1 Vmodulação 0 N014 AmostragemI- vccs
RL N014 AmostragemI+ R
RL N027 N034 R
* LPC-Link2
* LPC4370
* Iout
* Iout
.lib .\OPA861Model.sub
.lib .\ad8130.cir
.backanno
.end